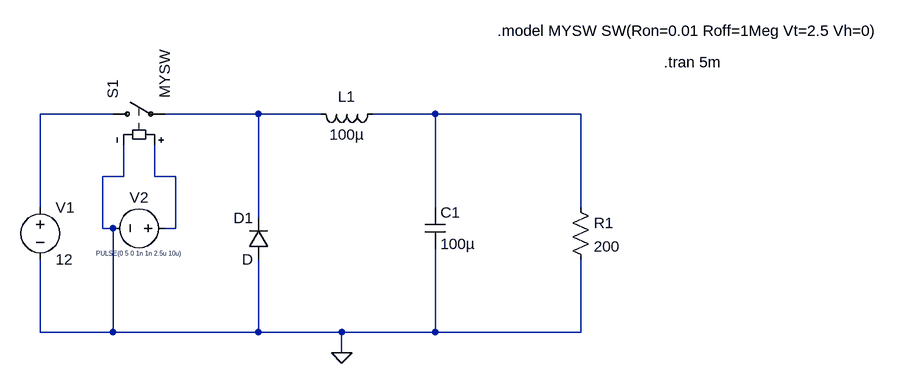
[diagram p0: schematic my_buck.asc]
my_buck.asc, the LTspice schematic file:
Version 4.1
SHEET 1 1244 680
WIRE 16 0 -96 0
WIRE 240 0 96 0
WIRE 336 0 240 0
WIRE 512 0 416 0
WIRE 736 0 512 0
WIRE 32 96 32 48
WIRE 32 96 0 96
WIRE 80 96 80 48
WIRE 112 96 80 96
WIRE -96 144 -96 0
WIRE 512 144 512 0
WIRE 736 144 736 0
WIRE 240 160 240 0
WIRE 0 176 0 96
WIRE 16 176 0 176
WIRE 112 176 112 96
WIRE 112 176 96 176
WIRE -96 336 -96 224
WIRE 16 336 16 176
WIRE 16 336 -96 336
WIRE 240 336 240 224
WIRE 240 336 16 336
WIRE 368 336 240 336
WIRE 512 336 512 208
WIRE 512 336 368 336
WIRE 736 336 736 224
WIRE 736 336 512 336
WIRE 368 368 368 336
FLAG 368 368 0
SYMBOL voltage -96 128 R0
WINDOW 123 0 0 Left 0
WINDOW 39 0 0 Left 0
SYMATTR InstName V1
SYMATTR Value 12
SYMBOL ind 432 -16 R90
WINDOW 0 5 56 VBottom 2
WINDOW 3 32 56 VTop 2
SYMATTR InstName L1
SYMATTR Value 100µ
SYMBOL diode 256 224 R180
WINDOW 0 24 64 Left 2
WINDOW 3 24 0 Left 2
SYMATTR InstName D1
SYMBOL cap 496 144 R0
SYMATTR InstName C1
SYMATTR Value 100µ
SYMBOL res 720 128 R0
SYMATTR InstName R1
SYMATTR Value 200
SYMBOL sw 0 0 R270
SYMATTR InstName S1
SYMATTR Value MYSW
SYMBOL voltage 112 176 R90
WINDOW 0 -32 56 VBottom 2
WINDOW 3 32 56 VTop 0
WINDOW 123 0 0 Left 0
WINDOW 39 0 0 Left 0
SYMATTR InstName V2
SYMATTR Value PULSE(0 5 0 1n 1n 2.5u 10u)
TEXT 608 -128 Left 2 !.model MYSW SW(Ron=0.01 Roff=1Meg Vt=2.5 Vh=0)
TEXT 864 -80 Left 2 !.tran 5m

The netlist it stands for:
* my_buck.asc
V1 N001 0 12
L1 N003 N002 100µ
D1 0 N002 D
C1 N003 0 100µ
R1 N003 0 200
S1 N001 N002 N004 0 MYSW
V2 N004 0 PULSE(0 5 0 1n 1n 2.5u 10u)
.model D D
.lib standard.dio
.model MYSW SW(Ron=0.01 Roff=1Meg Vt=2.5 Vh=0)
.tran 5m
.backanno
.end